# EAGLE design RJ11-6-PIN Breakout (EAGLE 9.6.2)
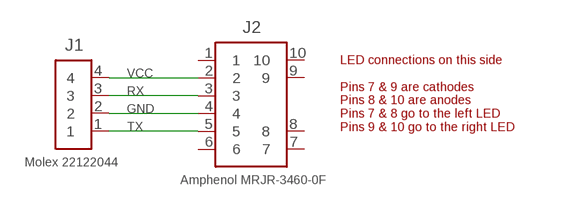
[diagram p0: schematic, sheet 1]

## Parts
J1  Molex 22122044  PINHD-1X4RA-MOLEX-22122044  [1X04RA-MOLEX-22122044]
J2  Amphenol MRJR-3460-0F  RJ11-6-PIN  [RJ11-6-PIN]

## Nets
GND: J1.2 J2.4
RX: J1.3 J2.3
TX: J1.1 J2.5
VCC: J1.4 J2.2
Unconnected: J2.1 J2.6 J2.7 J2.8 J2.9 J2.10

## Notes on the sheet
- LED connections on this side
  
  Pins 7 & 9 are cathodes
  Pins 8 & 10 are anodes
  Pins 7 & 8 go to the left LED
  Pins 9 & 10 go to the right LED

## Library data of the parts
J1 = AUmlib:PINHD-1X4RA-MOLEX-22122044
J2 = AUmlib:RJ11-6-PIN

## Board
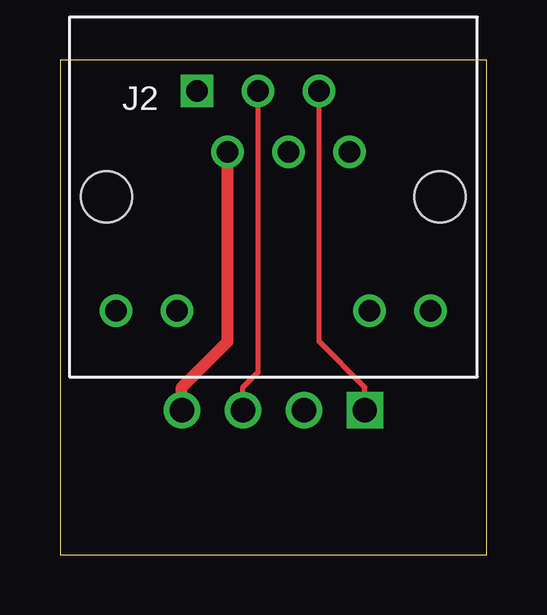
[diagram p1: board, top side]
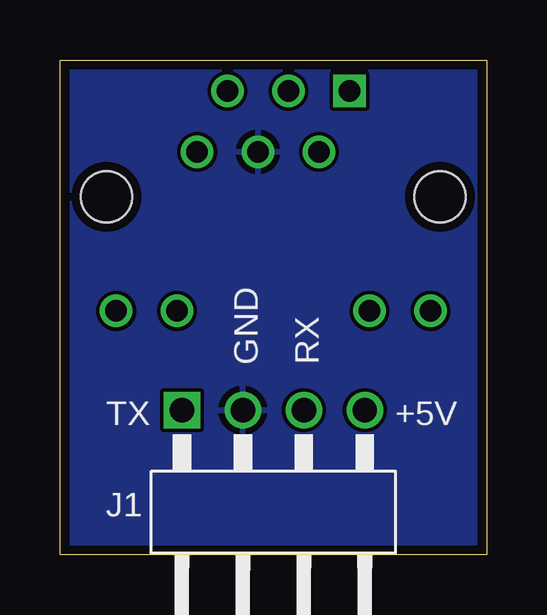
[diagram p2: board, bottom side, seen from below]

Size 17.78 x 20.64 mm. Coordinates in mm from the lower left corner, seen from the top.
Outline: 0,0 17.78,0 17.78,20.64 0,20.64 0,0
Copper layers (1*16): Top 0.035559375mm / dielectric 1.6mm / Bottom 0.035559375mm
Design rules "oshpark-2layer": minimum track width 6mil, minimum drill 10mil, track to track 6mil, track to pad 6mil, pad to pad 6mil, via to via 6mil, smd to smd 6mil, copper to edge 15mil, drill to drill 6mil, minimum pad ring 5mil, minimum via ring 5mil, stop-mask expansion 2.5mil, vias tented up to drill 0mil, thermal gap 10mil

### Footprints (pad centres in the part's own frame; a part is rotated, then mirrored left to right if it is on the bottom)
1X04RA-MOLEX-22122044 = drill 1.016 square: 1 -5.08,3.81 | drill 1.016: 2 -2.54,3.81; 3 0,3.81; 4 2.54,3.81
RJ11-6-PIN = drill 0.9 square: 1 -3.175,4.42 | drill 0.9: 2 -1.905,1.88; 3 -0.635,4.42; 4 0.635,1.88; 5 1.905,4.42; 6 3.175,1.88; 7 6.55,-4.75; 8 4.01,-4.75; 9 -4.01,-4.75; 10 -6.55,-4.75 | hole 2.13: 6.95,0; -6.95,0

### Placement (x,y rotation side)
J1  7.62,2.22 0 bottom
J2  8.89,14.92 0 top

### Tracks (layer width: path | path; a pad name or v marks a point on that pad's centre or on a via)
GND
  pour Bottom: 0,0 17.78,0 17.78,20.64 0,20.64
RX
  Top 0.203: J1.3 7.62,6.99 8.26,7.62 J2.3
TX
  Top 0.203: J1.1 12.7,6.99 10.79,8.89 J2.5
VCC
  Top 0.508: J1.4 5.08,6.99 6.99,8.89 J2.2

### Text on the board
bPlace: RX | GND | +5V | TX